# EasyEDA Pro project V2.0.2 Signal Relay Switch.epro

# Schematic V2.0.2 Schematic
Create Date: 2024-05-28; Page Name: Main Page; Project Name: Access Control Signal Relay Switch; Schematic Name: V2.0.2 Schematic; Update Date: 2024-05-28; Company: RIT SHED MAKERSPACE; Drawn: Jim Heaney; Page Size: A4; Part Number: JLCPCB-002; Reviewed: Jim Heaney; Version: V0.1
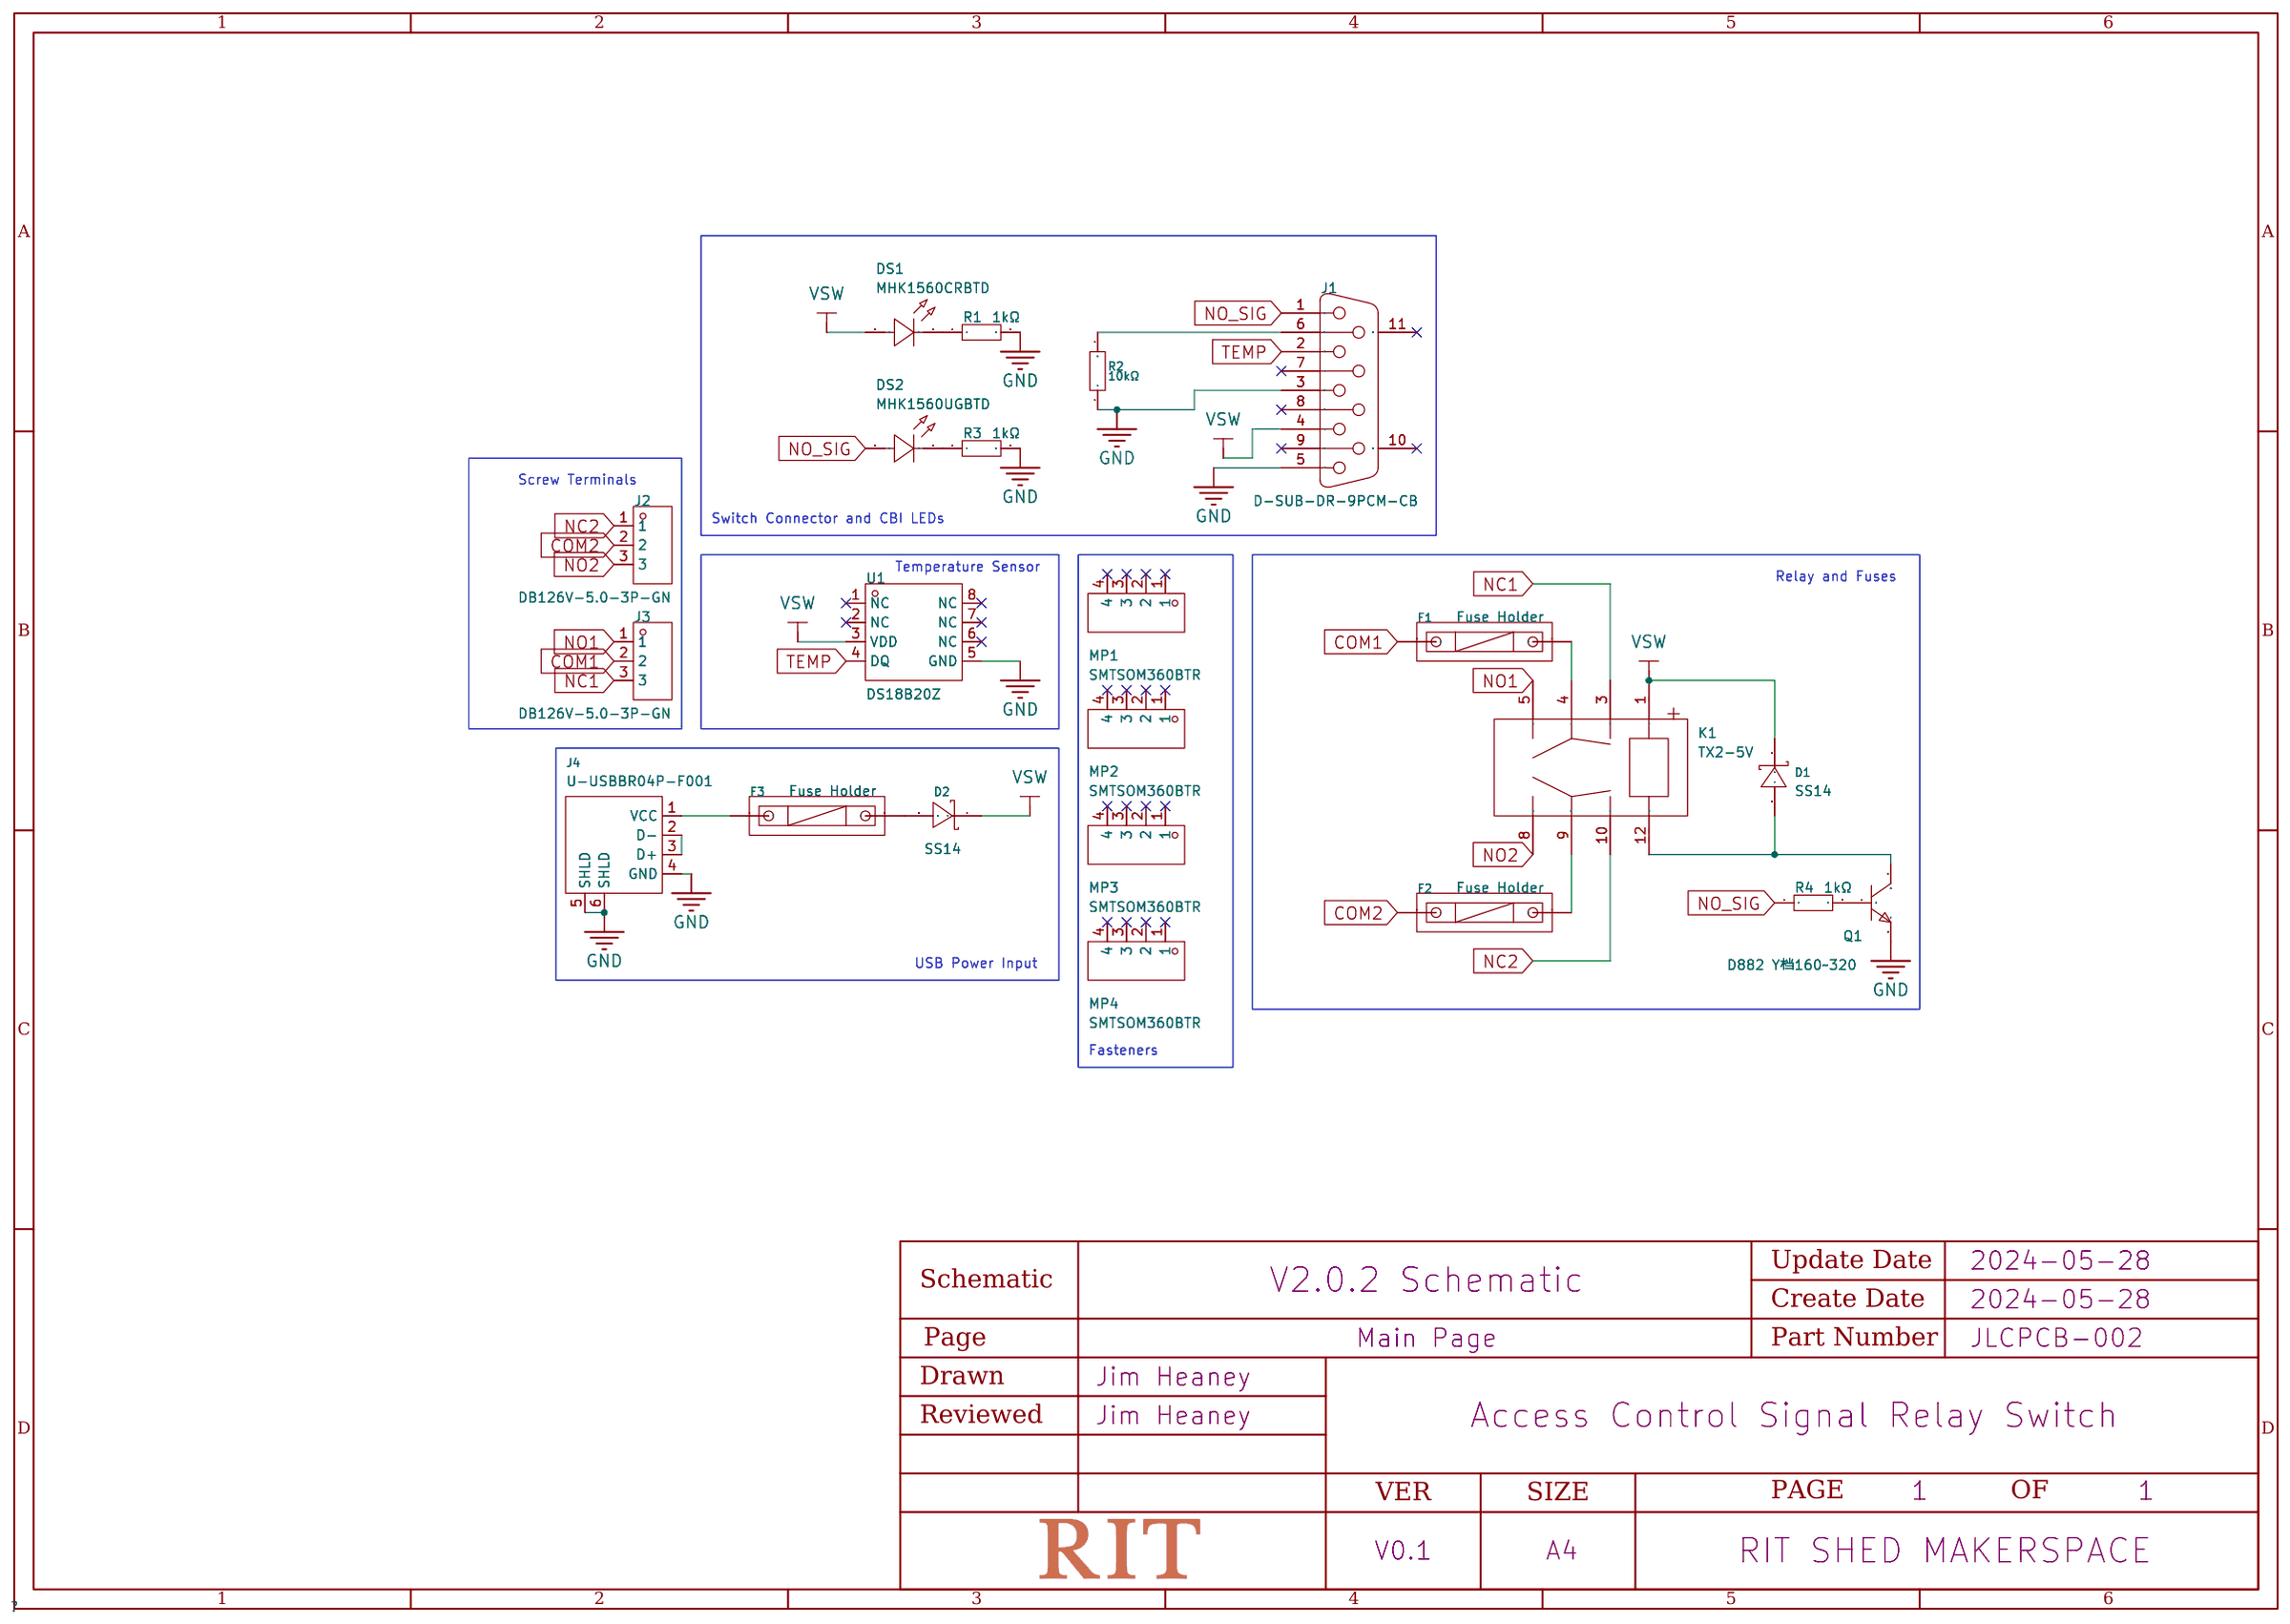
[diagram p0: schematic sheet]

## Parts
D1  SS14  [SMA_L4.2-W2.6-LS5.3-RD]
D2  SS14  [SMA_L4.2-W2.6-LS5.3-RD]
DS1  MHK1560CRBTD  [LED-TH_MHK1560UGBTD]
DS2  MHK1560UGBTD  [LED-TH_MHK1560UGBTD]
F1  Fuse Holder  [FUSE-TH_L24.5-W9.8-P22.5]
F2  Fuse Holder  [FUSE-TH_L24.5-W9.8-P22.5]
F3  Fuse Holder  [FUSE-TH_L24.5-W9.8-P22.5]
J1  D-SUB-DR-9PCM-CB  [DB9-TH_ID09S33E4GV00LF]
J2  DB126V-5.0-3P-GN  [CONN-TH_3P-P5.00_DB126V-5.0-3P]
J3  DB126V-5.0-3P-GN  [CONN-TH_3P-P5.00_DB126V-5.0-3P]
J4  U-USBBR04P-F001  [USB-B-TH_U241-041N-1BR85-1]
K1  TX2-5V  [RELAY-TH_TX2-3V]
MP1  SMTSOM360BTR  [SMD_BD5.6-D4.1]
MP2  SMTSOM360BTR  [SMD_BD5.6-D4.1]
MP3  SMTSOM360BTR  [SMD_BD5.6-D4.1]
MP4  SMTSOM360BTR  [SMD_BD5.6-D4.1]
Q1  D882 Y档160~320  [SOT-89-3_L4.5-W2.5-P1.50-LS4.2-BR]
R1  1kΩ  [R0805]
R2  10kΩ  [R0805]
R3  1kΩ  [R0805]
R4  1kΩ  [R0805]
U1  DS18B20Z  [SOP-8_L4.9-W3.9-P1.27-LS6.0-BL]

## Library data of the parts
D1 D2 = SS14_C2480: Diode Configuration:Single Forward Voltage (Vf@If):550mV@1A Reverse Voltage (Vr):40V Average Rectified Current (Io):1A Reverse Leakage Current (Ir):500uA@40V; LCSC Part Name: 电压:40V 电流:1A; Supplier Part: C2480; Manufacturer: MDD; Supplier Footprint: SMA(DO-214AC); JLCPCB Part Class: Basic Part; Datasheet: https://atta.szlcsc.com/upload/public/pdf/source/20230712/2DB6064CFBB99DE6DB116BEE8208BE66.pdf; Supplier: LCSC; Diode Configuration: Single; Forward Voltage (Vf@If): 550mV@1A; Reverse Voltage (Vr): 40V; Average Rectified Current (Io): 1A; Reverse Leakage Current (Ir): 500uA@40V
DS1 = MHK1560CGBTD: 20mA 雾状红透镜 50mcd -40℃~+85℃ 632nm Red 85° 1.75V~2.2V Plugin,P=2.54mm Light Emitting Diodes (LED) ROHS; LCSC Part Name: 1560直插单灯翠绿色光; Supplier Part: C7470835; Manufacturer: MEIHUA(美华); Supplier Footprint: 插件,P=2.54mm; JLCPCB Part Class: Extended Part; Datasheet: https://atta.szlcsc.com/upload/public/pdf/source/20231114/0151DB1F997DCF286213A722D08B4BAA.pdf; Supplier: LCSC; Emitted Color: Emerald; Forward Voltage (VF): 1.75V~2.2V; Forward Current: 20mA; Dominant Wavelength: 520nm; Lens Color: 雾状绿透镜; Luminous Intensity: 1000mcd; Viewing Angle: 85°; Operating Temperature: -40℃~+85℃
DS2 = MHK1560UGBTD: Emitted Color:Emerald Forward Voltage (VF):1.75V~2.2V Forward Voltage (VF):1.75V~2.2V Forward Current:20mA Dominant Wavelength:520nm Dominant Wavelength:520nm Lens Color:雾状绿透镜 Luminous Intensity:1000mcd Luminous Intensity:1000mcd Viewing Angle:85° Operati; LCSC Part Name: 1560直插单灯翠绿色光; Supplier Part: C7470833; Manufacturer: MEIHUA(美华); Supplier Footprint: 插件,P=2.54mm; JLCPCB Part Class: Extended Part; Datasheet: https://atta.szlcsc.com/upload/public/pdf/source/20231114/0151DB1F997DCF286213A722D08B4BAA.pdf; Supplier: LCSC; Emitted Color: Emerald; Forward Voltage (VF): 1.75V~2.2V; Forward Current: 20mA; Dominant Wavelength: 520nm; Lens Color: 雾状绿透镜; Luminous Intensity: 1000mcd; Viewing Angle: 85°; Operating Temperature: -40℃~+85℃
F1-F3 = 保险丝透明座: Fuseholder Type:- Fuse Type:- Fuse Size:-; LCSC Part Name: 保险丝座 5*20 透明座(两件套); Supplier Part: C58066; Manufacturer: xcfuse(旭程); JLCPCB Part Class: Extended Part; Datasheet: https://atta.szlcsc.com/upload/public/pdf/source/20201109/C58066_EF84FEEE40948BE1BD26BCA72E4FE443.pdf; Supplier: LCSC
J1 = D-SUB-DR-9PCM-CB: Connector Type:D-Sub Gender:Female Number of Pins:9P Mounting Style:Right-Angle Number of Rows:2 Current Rating (Max):3A Contact Plating:Tin Operating Temperature Range:-50℃~+105℃ Operating Temperature Range:-50℃~+105℃; LCSC Part Name: D-Sub 母 P数:9P; Supplier Part: C19077337; Manufacturer: XUNPU(讯普); Supplier Footprint: 弯插; JLCPCB Part Class: Extended Part; Datasheet: https://atta.szlcsc.com/upload/public/pdf/source/20231108/FB2E8AB0BE4F620DDF3F7F4D0B9AFB97.pdf; Supplier: LCSC; Connector Type: D-Sub; Gender: Female; Number of Pins: 9P; Mounting Style: Right-Angle; Number of Rows: 2; Current Rating (Max): 3A; Contact Plating: Tin; Operating Temperature Range: -50℃~+105℃
J2 J3 = DB126V-5.0-3P-GN_C395850: Structure:1x3P Pitch:5mm Color:Green Mounting Style:Straight Current Rating (Max):15A Voltage Rating (Max):250V Number of Pins:3P Number of Rows:1 Wire Gauge - AWG:14~26 Wire Gauge - AWG:14~26 Wire Gauge - mm2:1.5 Wire Gauge - mm2:1.5 Number of PINs Per R; LCSC Part Name: 5mm 1x3P 排数:1 每排P数:3 直插; Supplier Part: C395850; Manufacturer: DORABO(地博电气); Supplier Footprint: 插件,P=5mm; JLCPCB Part Class: Extended Part; Datasheet: https://atta.szlcsc.com/upload/public/pdf/source/20190923/C430579_AF9BA03CE2C1D84969AE00515C7DEF19.pdf; Supplier: LCSC; Structure: 1x3P; Pitch: 5mm; Color: Green; Mounting Style: Straight; Current Rating (Max): 15A; Voltage Rating (Max): 250V; Number of Pins: 3P; Number of Rows: 1; Wire Gauge - AWG: 14~26; Wire Gauge - mm2: 1.5; Number of PINs Per Row: 3; Operating Temperature Range: -40℃~+105℃
J4 = U-USBBR04P-F001: Connector Type:Type-B Standard:USB 2.0 Gender:Female Number of Ports:1 Number of Contacts:4P Mounting Style:Right-Angle Current Rating - Power (Max):1.5A Operating Temperature Range:- Operating Temperature Range:-; LCSC Part Name: Type-B 母 弯插; Supplier Part: C386743; Manufacturer: Ckmtw(灿科盟); Supplier Footprint: 插件; JLCPCB Part Class: Extended Part; Datasheet: https://atta.szlcsc.com/upload/public/pdf/source/20190509/C386743_2E7BDE199FB40B6F97679D15D491C286.pdf; Supplier: LCSC; Connector Type: Type-B; Standard: USB 2.0; Gender: Female; Number of Ports: 1; Number of Contacts: 4P; Mounting Style: Right-Angle; Current Rating - Power (Max): 1.5A
K1 = TX2-5V: Coil Voltage:5V Contact Form:两组转换:2C(DPDT-转换) Pin Number:- Contact Rating:- Maximum Switching Voltage:220V@DC Contact Material:silver+Gold plating Coil Resistance:- Maximum Switching Current:2A Operate Time:4ms Release Time:4ms Coil Type:- Contact Resista; Supplier Part: C192257; Manufacturer: PANASONIC(松下); Supplier Footprint: DIP,7.4x15mm; JLCPCB Part Class: Extended Part; Datasheet: https://atta.szlcsc.com/upload/public/pdf/source/20180524/C192257_90ABE86BE073F309F1A3B364AFE43747.pdf; Supplier: LCSC; Coil Voltage: 5V; Contact Form: 两组转换:2C(DPDT-转换); Maximum Switching Voltage: 220V@DC; Contact Material: silver+Gold plating; Maximum Switching Current: 2A; Operate Time: 4ms; Release Time: 4ms; Operating Temperature: -40℃~+85℃
MP1-MP4 = SMTSOM360BTR: LCSC Part Name: YIYUAN(怡远)M3贴片螺母 铜镀锡 PCB贴片连接器SMTSOM360BTR; Supplier Part: C5221846; Manufacturer: YIYUAN(怡远); JLCPCB Part Class: Extended Part; Datasheet: https://atta.szlcsc.com/upload/public/pdf/source/20230202/A42D22DA7D93D728E13784C4003E4077.pdf; Supplier: LCSC
Q1 = D882 Y档160~320: Transistor Type: Collector Current (Ic): Collector-Emitter Breakdown Voltage (Vceo): Power Dissipation (Pd):; LCSC Part Name: D882 Y档160~320(RANGE:160-320) Y档 160~320; Supplier Part: C9634; Manufacturer: CJ(江苏长电/长晶); Supplier Footprint: SOT-89-3; JLCPCB Part Class: Basic Part; Datasheet: https://atta.szlcsc.com/upload/public/pdf/source/20121027/1457706543612.pdf; Supplier: LCSC
R1 R3 R4 = 0805W8F1001T5E: Type:Thick Film Resistors Resistance:1kΩ Tolerance:±1% Tolerance:±1% Power(Watts): Overload Voltage (Max): Temperature Coefficient:±100ppm/℃ Temperature Coefficient:±100ppm/℃ Operating Temperature Range:-55℃~+155℃ Operating Temperature Range:-55℃~+155℃; LCSC Part Name: 1kΩ ±1% 125mW 厚膜电阻; Supplier Part: C17513; Manufacturer: UNI-ROYAL(厚声); Supplier Footprint: 0805; JLCPCB Part Class: Basic Part; Datasheet: https://atta.szlcsc.com/upload/public/pdf/source/20200306/C422600_1E6D84923E4A46A82E41ADD87F860B5C.pdf; Supplier: LCSC; Type: Thick Film Resistors; Tolerance: ±1%; Temperature Coefficient: ±100ppm/℃; Operating Temperature Range: -55℃~+155℃
R2 = 0805W8F1002T5E: Type:Thick Film Resistors Resistance:10kΩ Tolerance:±1% Tolerance:±1% Power(Watts): Overload Voltage (Max): Temperature Coefficient:±100ppm/℃ Temperature Coefficient:±100ppm/℃ Operating Temperature Range:-55℃~+155℃ Operating Temperature Range:-55℃~+155℃; LCSC Part Name: 10kΩ ±1% 125mW 厚膜电阻; Supplier Part: C17414; Manufacturer: UNI-ROYAL(厚声); Supplier Footprint: 0805; JLCPCB Part Class: Basic Part; Datasheet: https://atta.szlcsc.com/upload/public/pdf/source/20200306/C422600_1E6D84923E4A46A82E41ADD87F860B5C.pdf; Supplier: LCSC; Type: Thick Film Resistors; Tolerance: ±1%; Temperature Coefficient: ±100ppm/℃; Operating Temperature Range: -55℃~+155℃
U1 = DS18B20Z: Resolution:±0.4℃ Resolution:±0.4℃ Supply Voltage:2.5V~5.5V Supply Voltage:2.5V~5.5V; LCSC Part Name: 温度传感器; Supplier Part: C695837; Manufacturer: UMW(友台半导体); Supplier Footprint: SOIC-8; JLCPCB Part Class: Extended Part; Datasheet: https://atta.szlcsc.com/upload/public/pdf/source/20231109/DC3DA9D47D486EF40A6E0F08B9A498E3.pdf; Supplier: LCSC; Resolution: ±0.4℃; Supply Voltage: 2.5V~5.5V

## Nets
GND: J1.3 J1.5 J4.4(GND) J4.5(SHLD) J4.6(SHLD) Q1.3(E) R1.2 R2.1 R3.2 U1.5(GND)
COM1: F1.1 J3.2
COM2: F2.1 J2.2
NC1: J3.3 K1.3
NC2: J2.1 K1.10
NO1: J3.1 K1.5
NO2: J2.3 K1.8
NO_SIG: DS2.2(A) J1.1 R4.1
TEMP: J1.2 U1.4(DQ)
VSW: D1.1(K) D2.1(K) DS1.2(A) J1.4 K1.1 U1.3(VDD)
$1N839: D1.2(A) K1.12 Q1.2(C)
$1N884: F1.2 K1.4
$1N893: F2.2 K1.9
$1N4107: J1.6 R2.2
$1N5885: F3.1 J4.1(VCC)
$1N5887: J4.2(D-) J4.3(D+)
$1N5890: D2.2(A) F3.2
$1N6047: Q1.1(B) R4.2
$1N6126: DS2.1(K) R3.1
$1N6129: DS1.1(K) R1.1

Not connected (* = marked no-connect by the designer): J1 7* 8* 9* 10(MH1)* 11(MH2)*; MP1 1* 2* 3* 4*; MP2 1* 2* 3* 4*; MP3 1* 2* 3* 4*; MP4 1* 2* 3* 4*; U1 1(NC)* 2(NC)* 6(NC)* 7(NC)* 8(NC)*

## Notes on the sheet
- Screw Terminals
- Switch Connector and CBI LEDs
- Temperature Sensor
- Relay and Fuses
- USB Power Input
- Fasteners

# Board V2.0.2 PCB
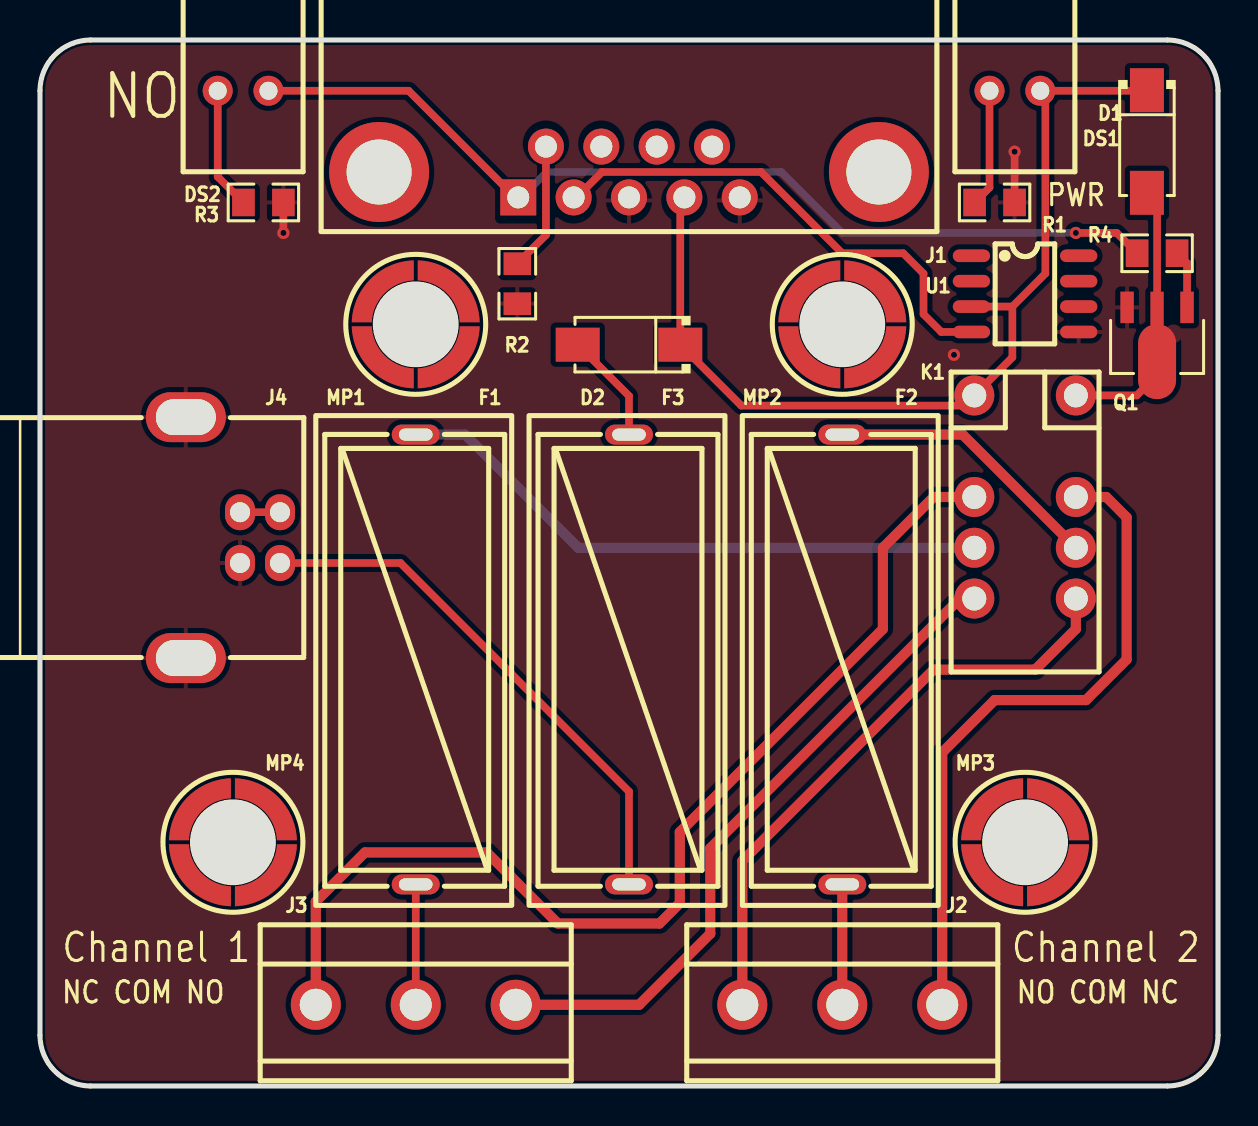
[diagram p1: board, top side]
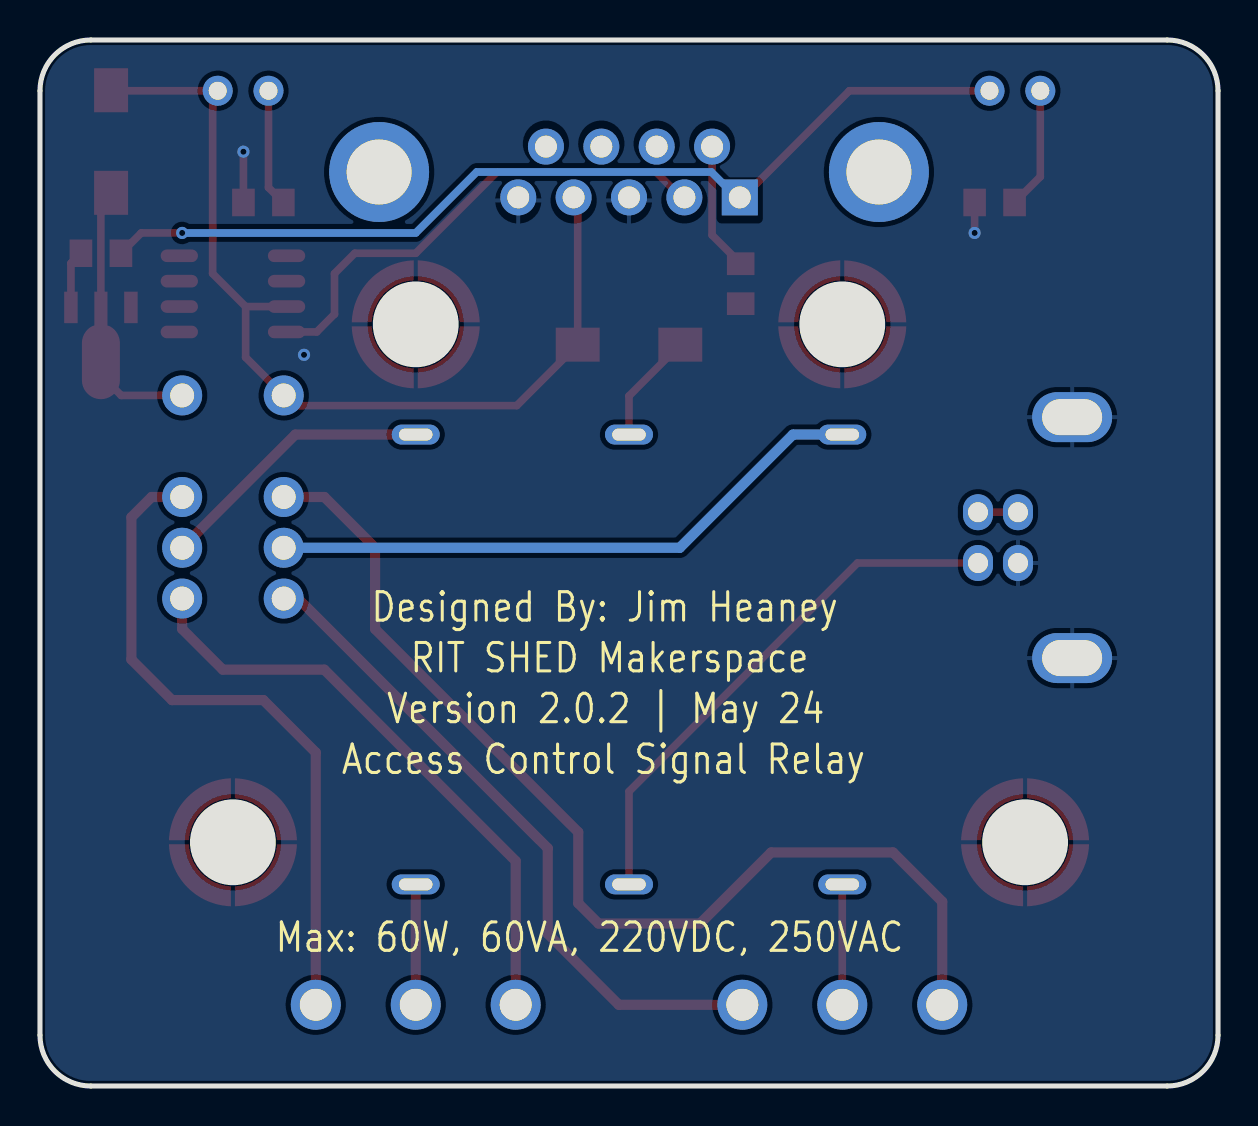
[diagram p2: board, bottom side, seen from below]

Outline 58.93 x 52.32 mm; copper layers: Top Layer, Bottom Layer. Coordinates in mm from the lower left corner of the outline.
Outline path: 0,49.78 0,2.54 arc(0.74,0.74) 2.54,0 56.39,0 arc(58.18,0.74) 58.93,2.54 58.93,49.78 arc(58.18,51.58) 56.39,52.32 2.54,52.32 arc(0.74,51.58) 0,49.78
Stack: Top Layer 0.035mm / Dielectric1 1.51mm FR4 er 4.5 / Bottom Layer 0.035mm

## Design rules (mm)
template: JLCPCB Capability(Two Layers Board)
spacing copperThickness1oz (default): track to track 0.102, other pairs 0.152 to 0.3
spacing copperThickness2oz: track to track 0.203, other pairs 0.152 to 0.3
track width copperThickness1oz (default): min 0.127, default 0.254, max 2.54
track width copperThickness2oz: min 0.203, default 0.254, max 2.54
differential pair differentialPair (default): width min 0.127, default 0.254, max 2.54; gap min 0.152, default 0.152
via viaSize (default): diameter min 0.5, default 0.61, max 10; hole min 0.3, default 0.305, max 6.3

## Placement (name value [footprint] x y rotation side)
D1  SS14  [SMA_L4.2-W2.6-LS5.3-RD]  55.37 47.24 270 top
D2  SS14  [SMA_L4.2-W2.6-LS5.3-RD]  29.46 37.08 180 top
DS1  MHK1560CRBTD  [LED-TH_MHK1560UGBTD]  48.77 49.78 180 top
DS2  MHK1560UGBTD  [LED-TH_MHK1560UGBTD]  10.16 49.78 180 top
F1  Fuse Holder  [FUSE-TH_L24.5-W9.8-P22.5]  18.8 21.34 90 top
F2  Fuse Holder  [FUSE-TH_L24.5-W9.8-P22.5]  40.13 21.34 90 top
F3  Fuse Holder  [FUSE-TH_L24.5-W9.8-P22.5]  29.46 21.34 90 top
J1  D-SUB-DR-9PCM-CB  [DB9-TH_ID09S33E4GV00LF]  29.46 45.72 180 top
J2  DB126V-5.0-3P-GN  [CONN-TH_3P-P5.00_DB126V-5.0-3P]  40.13 4.06 180 top
J3  DB126V-5.0-3P-GN  [CONN-TH_3P-P5.00_DB126V-5.0-3P]  18.8 4.06 180 top
J4  U-USBBR04P-F001  [USB-B-TH_U241-041N-1BR85-1]  9.65 27.43 270 top
K1  TX2-5V  [RELAY-TH_TX2-3V]  49.28 29.46 270 top
MP1  SMTSOM360BTR  [SMD_BD5.6-D4.1]  18.8 38.1 0 top
MP2  SMTSOM360BTR  [SMD_BD5.6-D4.1]  40.13 38.1 0 top
MP3  SMTSOM360BTR  [SMD_BD5.6-D4.1]  49.28 12.19 0 top
MP4  SMTSOM360BTR  [SMD_BD5.6-D4.1]  9.65 12.19 0 top
Q1  D882 Y档160~320  [SOT-89-3_L4.5-W2.5-P1.50-LS4.2-BR]  55.88 37.59 90 top
R1  1kΩ  [R0805]  47.75 44.2 0 top
R2  10kΩ  [R0805]  23.88 40.13 90 top
R3  1kΩ  [R0805]  11.18 44.2 0 top
R4  1kΩ  [R0805]  55.88 41.66 0 top
U1  DS18B20Z  [SOP-8_L4.9-W3.9-P1.27-LS6.0-BL]  49.28 39.62 270 top

## Footprints (pads in the part's own frame, mm; a bottom-side part is the same pattern mirrored in y, then rotated)
CONN-TH_3P-P5.00_DB126V-5.0-3P
  round 2.5 hole 1.6: 1(-5,0) 2(0,0) 3(5,0)
DB9-TH_ID09S33E4GV00LF
  rect 1.8x1.8 hole 1.1: 1(5.54,1.27)
  round 1.8 hole 1.1: 2(2.77,1.27) 3(0,1.27) 4(-2.77,1.27) 5(-5.54,1.27) 6(4.155,-1.27) 7(1.385,-1.27) 8(-1.385,-1.27) 9(-4.155,-1.27)
  round 5 hole 3.25: 10(-12.5,0) 11(12.5,0)
FUSE-TH_L24.5-W9.8-P22.5
  oval 1x2.4 hole 0.6x1.68: 1(-11.25,0) 2(11.25,0)
LED-TH_MHK1560UGBTD
  round 1.5 hole 0.9: 1(1.27,0) 2(-1.27,0)
R0805
  rect 1.133x1.377 smd: 1(-1,0) 2(1,0)
RELAY-TH_TX2-3V
  round 2 hole 1.2: 1(-5.08,-2.54) 3(0,-2.54) 4(2.54,-2.54) 5(5.08,-2.54) 8(5.08,2.54) 9(2.54,2.54) 10(0,2.54) 12(-5.08,2.54)
SMA_L4.2-W2.6-LS5.3-RD
  rect 2.2x1.7 smd: 1(-2.566,0) 2(2.566,0)
SMD_BD5.6-D4.1
  custom 3.1x3.1 smd: 1(-2.102,1.65) 2(1.65,2.102) 3(2.102,-1.65) 4(-1.65,-2.102)
SOP-8_L4.9-W3.9-P1.27-LS6.0-BL
  oval 0.63x1.865 smd: 1(-1.905,-2.683) 2(-0.635,-2.683) 3(0.635,-2.683) 4(1.905,-2.683) 5(1.905,2.683) 6(0.635,2.683) 7(-0.635,2.683) 8(-1.905,2.683)
SOT-89-3_L4.5-W2.5-P1.50-LS4.2-BR
  rect 1.575x0.672 smd: 1(1.356,-1.5) 3(1.356,1.5)
  custom 5.377x1.9 smd: 2(-1.356,0)
USB-B-TH_U241-041N-1BR85-1
  oval 1.8x1.5 hole 1: 1(1.27,2.355) 2(-1.27,2.355) 3(-1.27,0.355) 4(1.27,0.355)
  oval 2.5x4 hole 1.8x3: 5(6.025,-2.355) 6(-6.025,-2.355)

## Nets
As in the schematic.

Pads without a net: J1 7 8 9 10 11; MP1 1 2 3 4; MP2 1 2 3 4; MP3 1 2 3 4; MP4 1 2 3 4; U1 1 2 6 7 8

## Via types
v1: diameter 0.61, hole 0.305, Top Layer to Bottom Layer, 4 vias

## Routing (per net, layer and track width the routed paths; a pad name or vN(x,y) marks a point on that pad's centre or on a via; arc(x,y) is an arc through that point)
GND: length 4.1
  Top Layer w0.381: R3.2 v1(12.18,42.67) ; R1.2 v1(48.75,46.74)
  vias: v1(45.72,36.58)
COM1: length 6
  Top Layer w0.381: J3.2 F1.1
COM2: length 6
  Top Layer w0.508: J2.2 F2.1
NC1: length 53.9
  Top Layer w0.508: J3.3 13.8,9.22 16.26,11.68 22.35,11.68 25.91,8.13 30.99,8.13 32,9.14 32,12.7 42.16,22.86 42.16,26.92 44.7,29.46 K1.3
NC2: length 33.8
  Top Layer w0.508: K1.10 53.34,29.46 54.36,28.45 54.36,21.34 52.32,19.3 47.75,19.3 45.13,16.68 J2.1
NO1: length 33.9
  Top Layer w0.508: K1.5 46.02,24.38 33.53,11.89 33.53,7.62 29.97,4.06 J3.1
NO2: length 30.2
  Top Layer w0.508: J2.3 35.13,11.26 44.7,20.83 49.78,20.83 51.82,22.86 K1.8
NO_SIG: length 48
  Top Layer w0.381: DS2.2 18.44,49.78 23.92,44.3 ; v1(51.82,42.67) 53.86,42.67 R4.1
  Bottom Layer w0.381: v1(51.82,42.67) 40.13,42.67 37.08,45.72 25.34,45.72 23.92,44.3
TEMP: length 24.9
  Top Layer w0.381: 46.5,37.72 45.08,37.72 44.2,38.61 44.2,40.64 43.18,41.66 40.13,41.66 36.07,45.72 28.11,45.72 26.69,44.3
VSW: length 47.8
  Top Layer w0.381: 48.64,38.99 50.29,40.64 50.29,49.53 DS1.2 55.35,49.78 D1.1 ; 48.64,38.99 48.64,36.45 K1.1 46.23,34.04 35.08,34.04 D2.1 32.03,44.1 32.23,44.3 ; 48.64,38.99 46.5,38.99
$1N839: length 13.8
  Top Layer w0.381: K1.12 54.86,34.54 55.88,35.56 Q1.2 55.88,44.17 D1.2
$1N884: length 30.3
  Bottom Layer w0.508: F1.2 21.26,32.59 26.92,26.92 K1.4
$1N893: length 14
  Top Layer w0.508: F2.2 46.15,32.59 K1.9
$1N4107: length 6.6
  Top Layer w0.381: R2.2 25.31,42.56 25.31,47.14
$1N5885: length 26.8
  Top Layer w0.381: F3.1 29.46,14.73 18.03,26.16 J4.1
$1N5887: length 2
  Top Layer w0.381: J4.3 J4.2
$1N5890: length 5.6
  Top Layer w0.381: F3.2 29.46,34.52 D2.2
$1N6047: length 2.9
  Top Layer w0.381: R4.2 57.38,41.16 Q1.1
$1N6126: length 6.1
  Top Layer w0.381: DS2.1 8.89,45.48 R3.1
$1N6129: length 5.9
  Top Layer w0.381: R1.1 47.5,44.94 DS1.1

## Copper pours and planes (outline as drawn; the poured copper is in the pictures)
GND on Top Layer: -1.52,66.55 59.94,66.55 59.94,-11.68 -1.52,-11.68
GND on Bottom Layer: -9.65,54.36 67.06,54.36 67.06,-2.54 -9.65,-2.54

## Text on the board
Bottom Silkscreen Layer: Max: 60W, 60VA, 220VDC, 250VAC | RIT SHED Makerspace | Version 2.0.2 | May 24 | Designed By: Jim Heaney | Access Control Signal Relay
Document Layer: NOTE: Fixed the swapped labels that were on previous versions of silkscreen
Top Silkscreen Layer: NC COM NO | NO COM NC | PWR | Channel 1 | Channel 2 | NO
